# EAGLE design slaveMeteo (EAGLE 9.0.0)
DELETE: MF
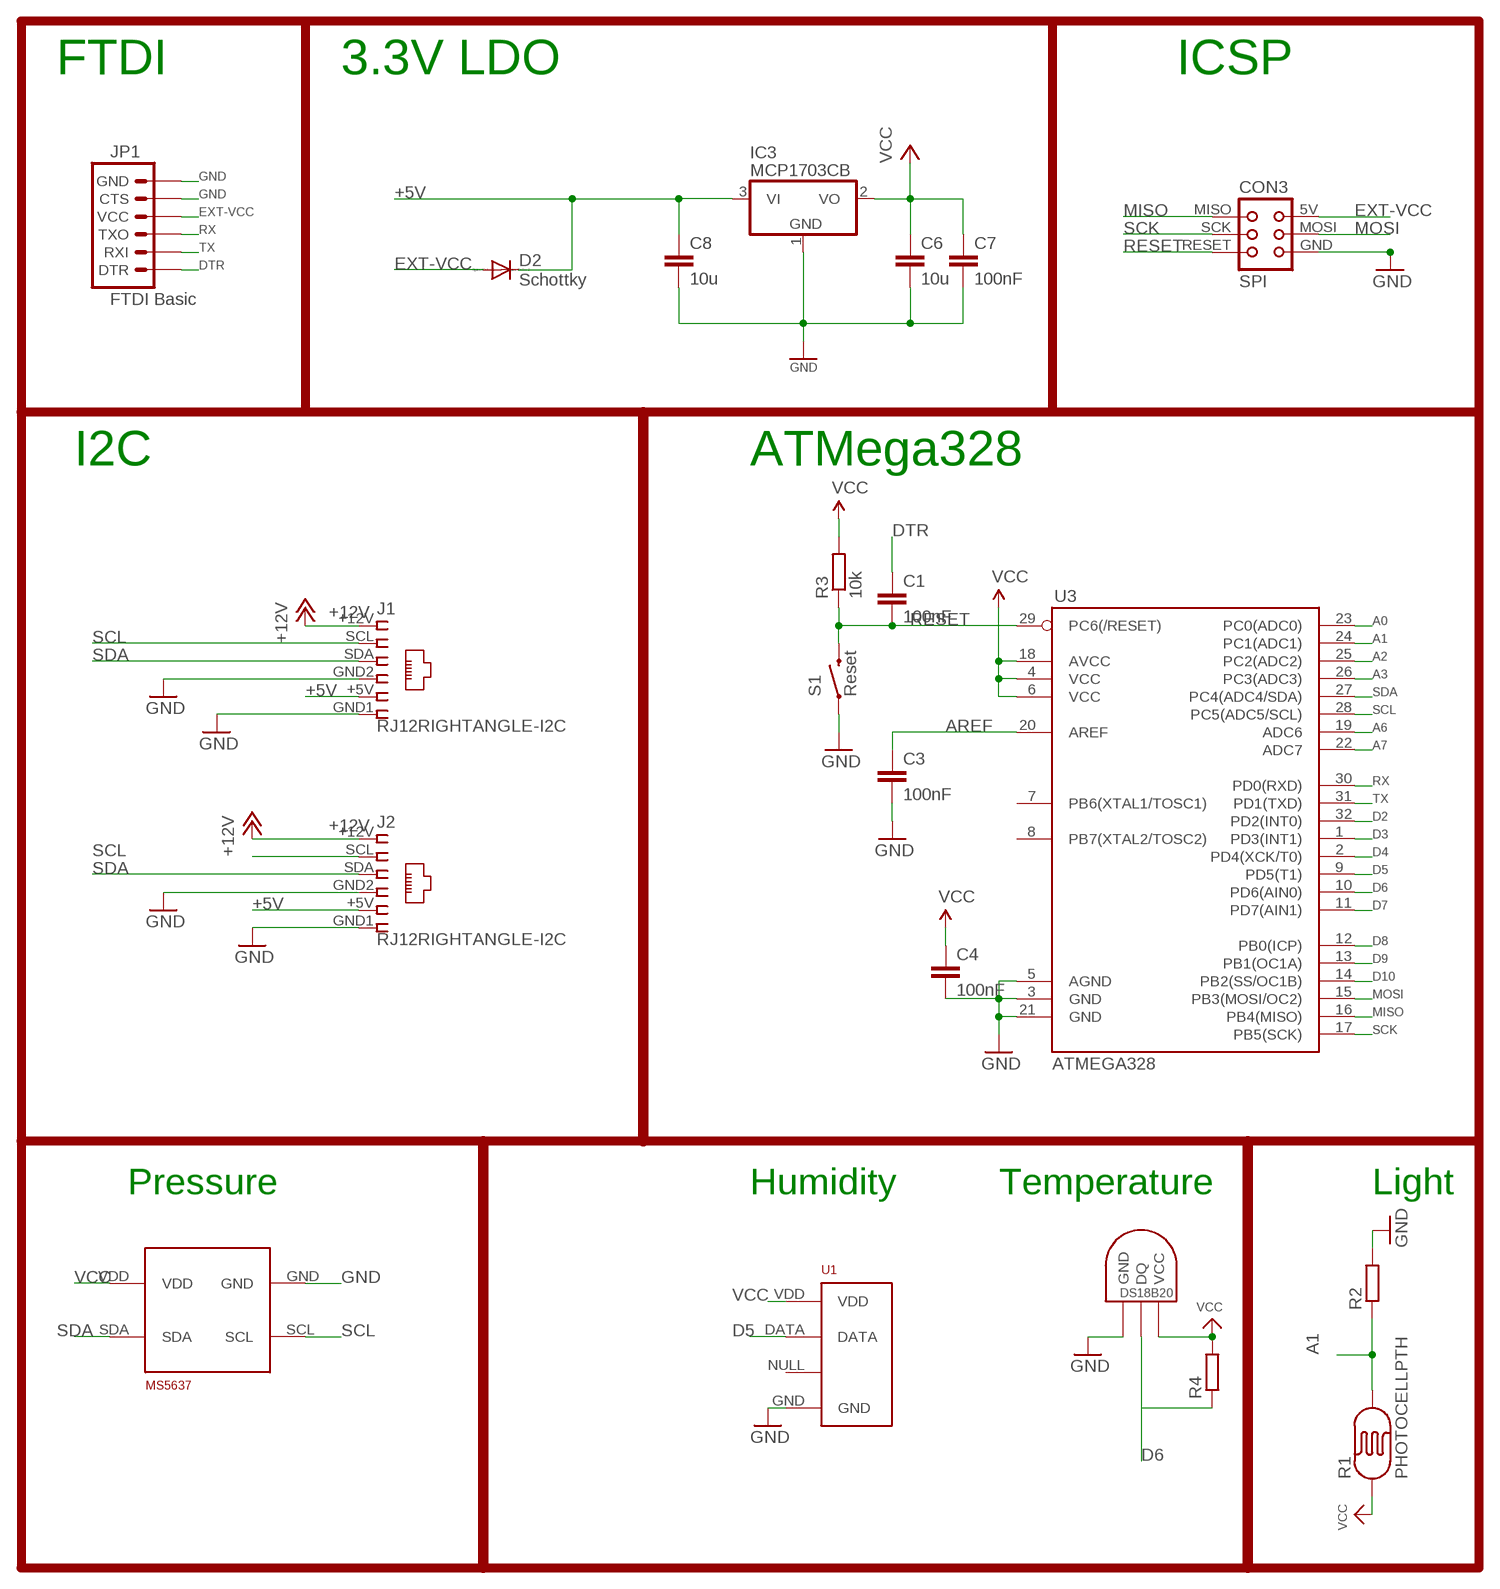
[diagram p0: schematic, sheet 1]

## Parts
C1  100nF  C-EUC0805K  [C0805K]
C3  100nF  C-EUC0805K  [C0805K]
C4  100nF  C-EUC0805K  [C0805K]
C6  10u  C-EUC0805K  [C0805K]
C7  100nF  C-EUC0805K  [C0805K]
C8  10u  C-EUC0805K  [C0805K]
CON3  SPI  TINYISPTAG  [TC2030-MCP]
D2  Schottky  MBR0520LT  [SOD123]
IC3  MCP1703CB  [SOT23]
J1  RJ12RIGHTANGLE-I2C  [RJ12-RIGHTANGLE-I2C]
J2  RJ12RIGHTANGLE-I2C  [RJ12-RIGHTANGLE-I2C]
JP1  FTDI Basic  ARDUINO_SERIAL_PROGRAMPTH  [1X06]
R1  PHOTOCELLPTH  [PHOTOCELL]
R2  R-EU_R0805  [R0805]
R3  10k  R-EU_R0805  [R0805]
R4  R-EU_R0805  [R0805]
S1  Reset  SWITCH-MOMENTARY-2SMD-ALT01  [TACTILE-SWITCH-SMD-ALT01]
U1  RHT03_DHT-22_AM2302RA  [RHT03_DHT-22/RA]
U3  ATMEGA328  ATMEGA168  [TQFP32-08]
U$1  DS1820TO92  [DS1820]
U$19  MS5637  [MS5637]

## Nets
+5V: C8.1 D2.C IC3.3(VI) J1.+5V J2.+5V
+12V [power]: J1.+12V J2.+12V
A0: U3.23(PC0(ADC0))
A1: R1.2 R2.1 U3.24(PC1(ADC1))
A2: U3.25(PC2(ADC2))
A3: U3.26(PC3(ADC3))
A6: U3.19(ADC6)
A7: U3.22(ADC7)
AREF: C3.1 U3.20(AREF)
D2: U3.32(PD2(INT0))
D3: U3.1(PD3(INT1))
D4: U3.2(PD4(XCK/T0))
D5: U1.DATA U3.9(PD5(T1))
D6: R4.1 U3.10(PD6(AIN0)) U$1.DQ
D7: U3.11(PD7(AIN1))
D8: U3.12(PB0(ICP))
D9: U3.13(PB1(OC1A))
D10: U3.14(PB2(SS/OC1B))
DTR: C1.1 JP1.1(DTR)
EXT-VCC: CON3.5V(VCC) D2.A JP1.4(VCC)
GND [power]: C3.2 C4.2 C6.2 C7.2 C8.2 CON3.GND IC3.1(GND) J1.GND1 J1.GND2 J2.GND1 J2.GND2 JP1.5(CTS) JP1.6(GND) R2.2 S1.1 S1.2 U1.GND U3.3(GND) U3.5(AGND) U3.21(GND) U$1.GND U$19.GND
MISO: CON3.MISO U3.16(PB4(MISO))
MOSI: CON3.MOSI U3.15(PB3(MOSI/OC2))
RESET: C1.2 CON3.RESET R3.1 S1.3 S1.4 U3.29(PC6(/RESET))
RX: JP1.3(TXO) U3.30(PD0(RXD))
SCK: CON3.SCK U3.17(PB5(SCK))
SCL: J1.SCL J2.SCL U3.28(PC5(ADC5/SCL)) U$19.SCL
SDA: J1.SDA J2.SDA U3.27(PC4(ADC4/SDA)) U$19.SDA
TX: JP1.2(RXI) U3.31(PD1(TXD))
VCC: C4.1 C6.1 C7.1 IC3.2(VO) R1.1 R3.2 R4.2 U1.VDD U3.4(VCC) U3.6(VCC) U3.18(AVCC) U$1.VDD(VCC) U$19.VDD
Unconnected: U1.NULL U3.7(PB6(XTAL1/TOSC1)) U3.8(PB7(XTAL2/TOSC2))

## Notes on the sheet
- FTDI | 3.3V LDO | ICSP
- I2C | ATMega328
- Pressure | Humidity | Temperature | Light

## Library data of the parts
C1 C3 C4 C7 = rcl:C-EU: CAPACITOR, European symbol; ELECROW: C49678; LCSC: C49678; MPN: 80-C1206C104K5R
C6 C8 = rcl:C-EU: CAPACITOR, European symbol; ELECROW: C15850; LCSC: C15850; MPN: 77-VJ1206V106ZXQTBC
CON3 = lpatiny:TINYISP: CONNECTOR
D2 = diode:MBR0520LT: SCHOTTKY BARRIER RECTIFIER Source: http://onsemi.com .. MBR0520LT1-D.pdf; LCSC: C82544; MPN: 621-1N5819HW-F
IC3 = linear:MCP1703: 250 mA, 16V, Low Quiescent Current LDO Regulator Source: http://ww1.microchip.com/downloads/en/DeviceDoc/22049b.pdf; LCSC: C53352
J1 J2 = lpatiny:RJ12: CORCOM Modular RJ Jacks No Shield Source: www.tycoelectronics.com .. ENG_DS_1654001_1099_RJ_L_0507.pdf
JP1 = SparkFun:ARDUINO_SERIAL_PROGRAM
R1 = SparkFun:PHOTOCELL: Photocell Also known as a CdS photoresistor. This is a low cost way to detect light levels. Resistance decreases with more incoming light. SparkFun SKU: SEN-09088
R2 R4 = resistor:R-EU_: RESISTOR, European symbol
R3 = rcl:R-EU_: RESISTOR, European symbol; ELECROW: C17513; LCSC: C17513
S1 = Testing:SWITCH-MOMENTARY-2: Various NO switches- pushbuttons, reed, etc
U1 = RHT03_DHT-22_AM2302:RHT03_DHT-22_AM2302: RHT03 / DHT-22 / AM2302 Packages and symbol for the RHT03 / DHT-22 relative humidity and temperature sensor. Note: The AM2302 is a wired version of the DHT-22 which typically requires less clearance and is thus provided as a separate package.; PROD_ID: SEN-10167
U3 = SparkFun:ATMEGA168
U$1 = Ava:DS1820: DS18B20 Programmable Resolution 1-Wire Digital Thermometer Description The DS18B20 digital thermometer provides 9-bit to 12-bit Celsius temperature measurements and has an alarm function with nonvolatile user-programmable upper and lower trigger points. The DS18B20 communicates over a 1-Wire® bus that by definition requires only one data line (and ground) for communication with a central microprocessor. It has an operating temperature range of -55°C to +125°C and is accurate to ±0.5°C over the range of -10°C to +85°C. In addition, the DS18B20 can derive power directly from the data line ("parasite power"), eliminating the need for an external power supply. Each DS18B20 has a unique 64-bit serial code, which allows multiple DS18B20s to function on the same 1-Wire bus. Thus, it is simple to use one microprocessor to control many DS18B20s distributed over a large area. Applications that can benefit from this feature include HVAC environmental controls, temperature monitoring systems inside buildings, equipment, or machinery, and process monitoring and control systems.
U$19 = MS5637:MS5637: Le MS563702BA03-50 est un Micro Altimètre ultra compact optimisé pour des applications d'altimètre et de baromètre dans des téléphones portables et des tablettes. La résolution d'altitude au niveau de la mer est de 13cm d'air. Le module de capteur comprend un capteur de pression haute linéarité et un CAN ΔΣ 24 bits ultra faible puissance avec des coefficients internes calibrés en usine. Il fournit une valeur numérique de pression et de température précise de 24 bits et différents modes de fonctionnement qui permettent à l'utilisateur d'optimiser la vitesse de conversion et la consommation de courant. La sortie de température à haute résolution permet la mise en œuvre d'une fonction altimètre / thermomètre sans capteur supplémentaire. Il peut être interfacé avec pratiquement tous les microcontrôleurs à interface I²C-bus. Le protocole de communication est simple, sans avoir à programmer des registres internes dans l'appareil. Faibles dimensions de 3 x 3 x 0.9mm³ pour une intégratio Module haute résolution, 13cm Capteur de pression numérique intégré (CAN ΔΣ 24 bits) Interface I²C Plage de pression étendue de 10 à 2000mbar Conversion rapide jusqu'à 0.5ms Faible consommation, 0.6µA (veille <=0.1µA à 25°C) Aucun composant externe (oscillateur interne)

## Net classes
0 default: width 0.406 mm, clearance 0.25 mm
1 power: width 0.406 mm, drill 0.305 mm, clearance 0.25 mm
2 VIN: width 0.406 mm, clearance 0.25 mm
3 fine: width 0.406 mm, clearance 0.25 mm
4 aref: width 0.406 mm, clearance 0.25 mm

## Board
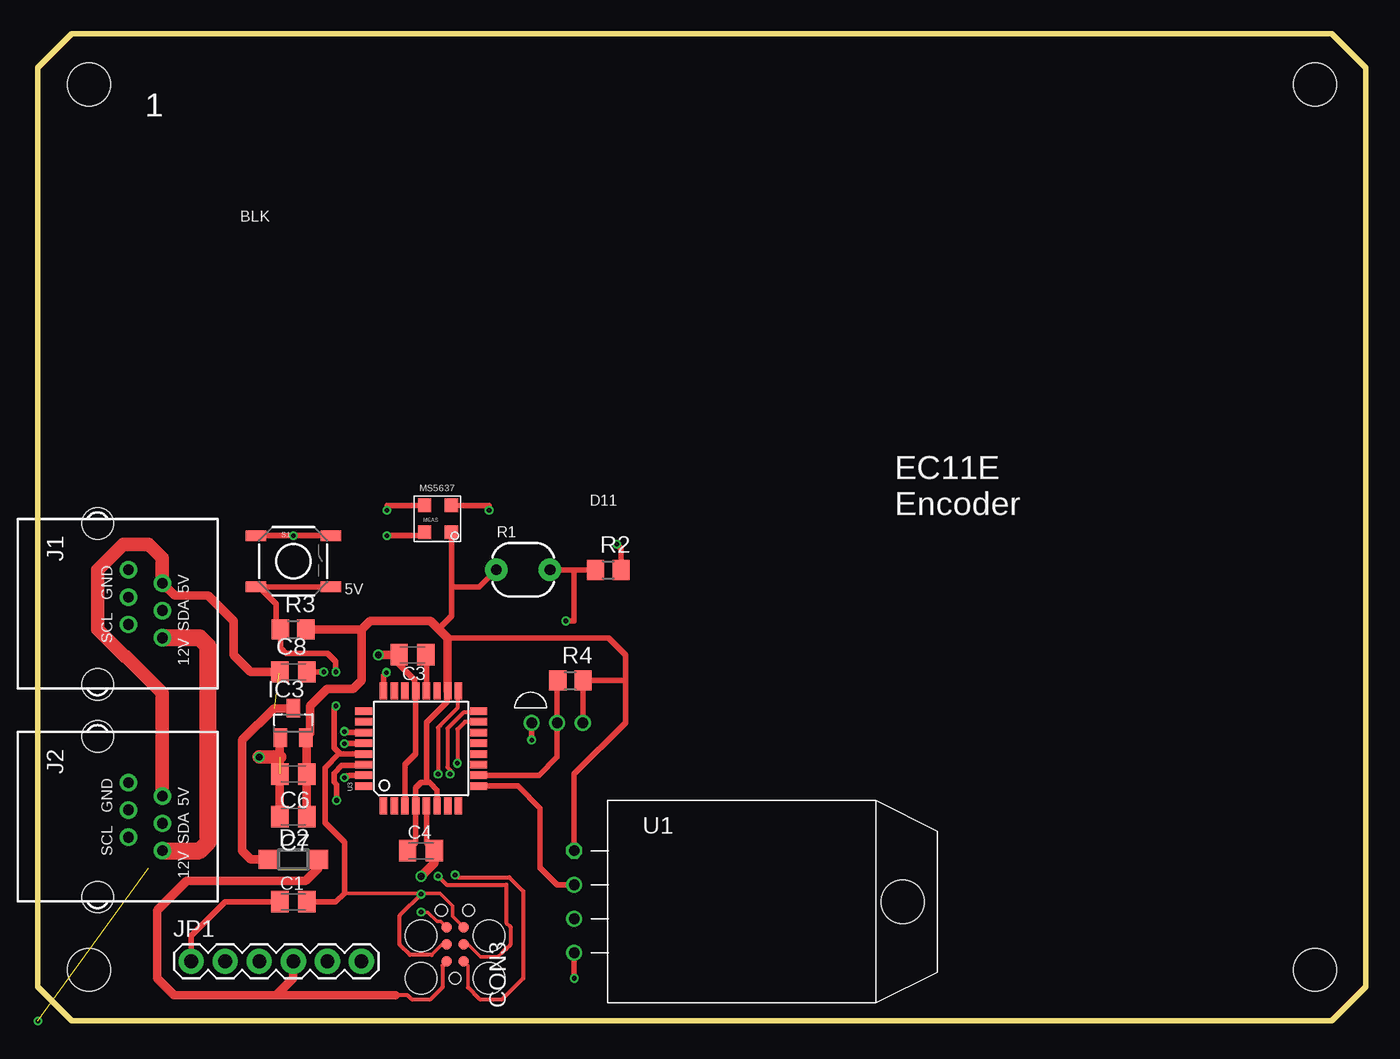
[diagram p1: board, top side]
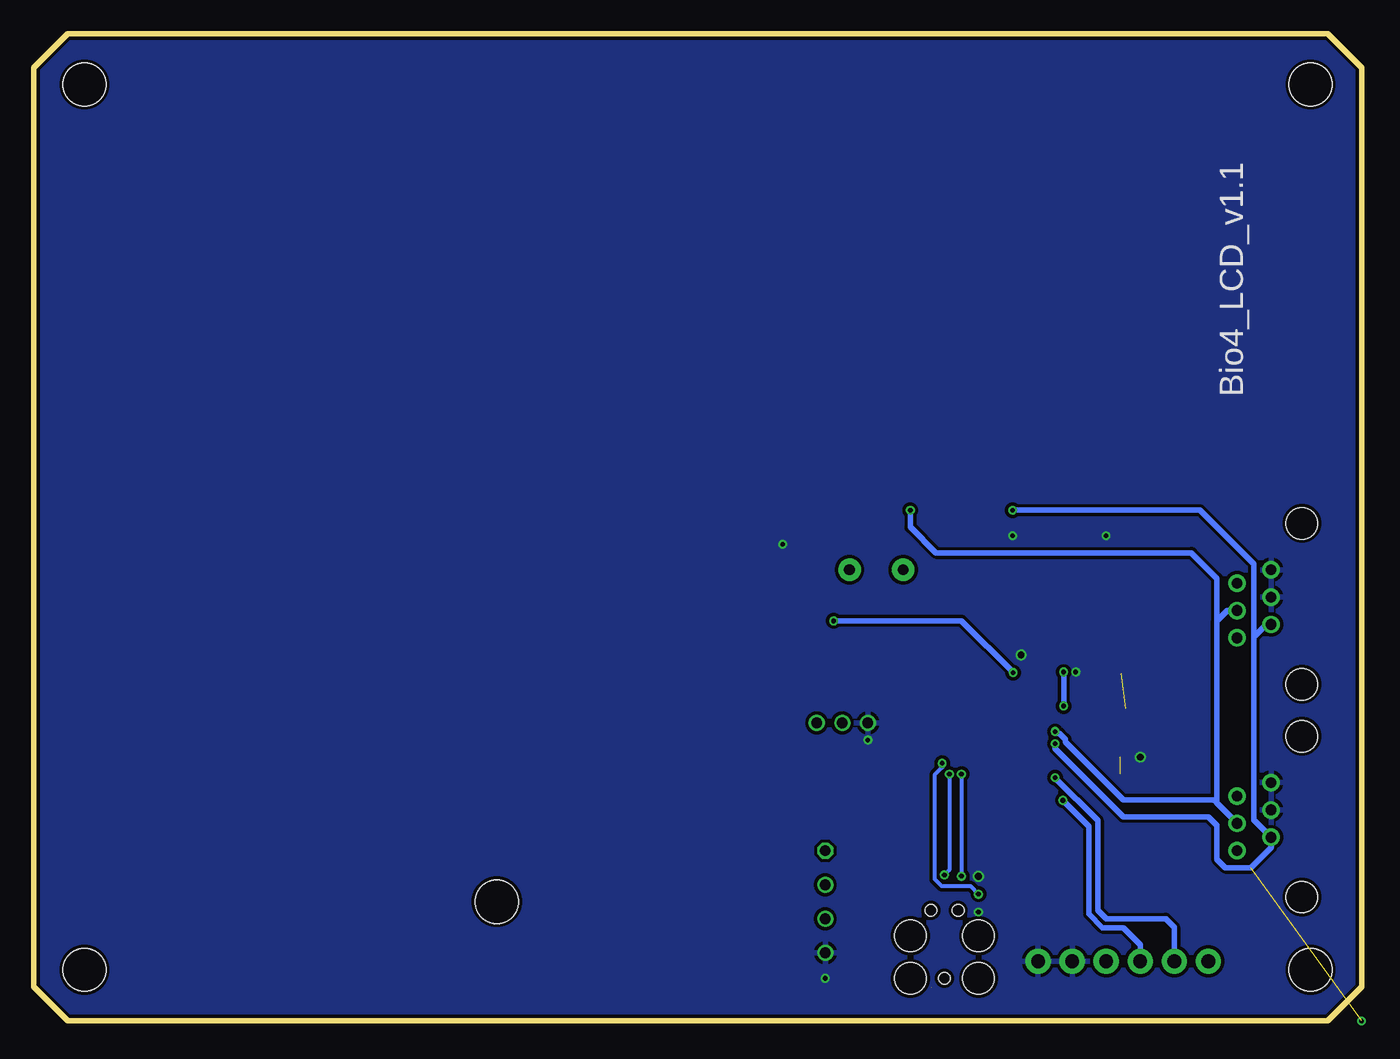
[diagram p2: board, bottom side, seen from below]

Size 99.06 x 73.66 mm. Coordinates in mm from the lower left corner, seen from the top.
Outline: 0,71.12 0,2.54 2.54,0 96.52,0 99.06,2.54 99.06,71.12 96.52,73.66 2.54,73.66 0,71.12
Copper layers (1*16): Top 0.035mm / dielectric 0.2mm / Bottom 0.035mm
Design rules "SeeedStudio_DRU_no_angle_20130527 *": minimum track width 6mil, minimum drill 12mil, track to track 6mil, track to pad 6mil, pad to pad 6mil, via to via 6mil, smd to smd 0mil, copper to edge 10mil, drill to drill 10mil, minimum pad ring 6mil, minimum via ring 6mil, stop-mask expansion 2mil, vias tented up to drill 25mil, thermal gap 10mil
Holes 3.2 mm at 3.81,69.85 3.81,3.81 95.25,69.85 95.25,3.81

### Footprints (pad centres in the part's own frame; a part is rotated, then mirrored left to right if it is on the bottom)
C0805K = smd 1.3 x 1.6: 1 -1,0; 2 1,0
TC2030-MCP = smd 0.787 x 0.787: 5V 1.27,0.635; GND 3.81,0.635; MISO 1.27,-0.635; MOSI 2.54,0.635; RESET 3.81,-0.635; SCK 2.54,-0.635 | hole 0.889: 0,0; 5.08,-1.016; 5.08,1.016 | hole 2.375: 0,2.54; 0,-2.54; 3.175,-2.54; 3.175,2.54
SOD123 = smd 1.4 x 1.4: A 1.9,0; C -1.9,0
SOT23 = smd 1 x 1.4: 1 -0.95,-1.1; 2 0.95,-1.1; 3 0,1.1
RJ12-RIGHTANGLE-I2C = drill 0.8 pad 1.3: +5V -1.54,4.84; +12V 2.54,4.84; GND1 -2.54,2.3; GND2 -0.5,2.3; SCL 1.54,2.3; SDA 0.5,4.84 | hole 2.36: -6,0; 6,0
1X06 = drill 1.016 pad 1.88: 1 0,0; 2 2.54,0; 3 5.08,0; 4 7.62,0; 5 10.16,0; 6 12.7,0
PHOTOCELL = drill 0.8 pad 1.676: 1 -2,0; 2 2,0
R0805 = smd 1.3 x 1.5: 1 -0.95,0; 2 0.95,0
TACTILE-SWITCH-SMD-ALT01 = smd 1.524 x 0.762: 1 -2.794,1.905; 2 2.794,1.905; 3 -2.794,-1.905; 4 2.794,-1.905
RHT03_DHT-22/RA = drill 0.8: DATA -1.27,0; GND 3.81,0; NULL 1.27,0 | drill 0.8 octagon: VDD -3.81,0 | hole 3.25: 0,24.5
TQFP32-08 = smd 1.27 x 0.559: 1 -4.293,2.8; 2 -4.293,2; 3 -4.293,1.2; 4 -4.293,0.4; 5 -4.293,-0.4; 6 -4.293,-1.2; 7 -4.293,-2; 8 -4.293,-2.8; 17 4.293,-2.8; 18 4.293,-2; 19 4.293,-1.2; 20 4.293,-0.4; 21 4.293,0.4; 22 4.293,1.2; 23 4.293,2; 24 4.293,2.8 | smd 0.559 x 1.27: 9 -2.8,-4.293; 10 -2,-4.293; 11 -1.2,-4.293; 12 -0.4,-4.293; 13 0.4,-4.293; 14 1.2,-4.293; 15 2,-4.293; 16 2.8,-4.293; 25 2.8,4.293; 26 2,4.293; 27 1.2,4.293; 28 0.4,4.293; 29 -0.4,4.293; 30 -1.2,4.293; 31 -2,4.293; 32 -2.8,4.293
DS1820 = drill 0.8: DQ 2.54,-1.27; GND 0.635,-1.27; VDD 4.445,-1.27
MS5637 = smd 1 x 1: GND 1,1; SCL 1,-1; SDA -1,-1; VDD -1,1

### Placement (x,y rotation side)
C1  19.05,8.89 0 top
C3  27.94,27.3 180 top
C4  28.57,12.7 0 top
C6  19.05,18.41 180 top
C7  19.05,15.24 180 top
C8  19.05,26.04 0 top
CON3  31.11,3.17 90 top
D2  19.05,12.06 0 top
IC3  19.05,22.23 0 top
J1  4.45,31.11 270 top
J2  4.45,15.24 270 top
JP1  11.43,4.45 0 top
R1  36.2,33.66 0 top
R2  42.55,33.66 0 top
R3  19.05,29.21 0 top
R4  39.71,25.4 0 top
S1  19.05,34.29 0 top
U1  40.01,8.89 270 top
U3  28.57,20.32 90 top
U$1  36.2,23.5 0 top
U$19  29.84,37.47 180 top

### Tracks (layer width: path | path; a pad name or v marks a point on that pad's centre or on a via)
+5V  (1 unrouted)
  Top 0.635: D2.C 15.88,12.06 15.24,12.7 15.24,20.95 17.61,23.32 IC3.3 | J1.+5V 10.19,31.75 12.7,31.75 14.61,29.84 14.61,27.3 15.88,26.04 C8.1
  Top 1.016: J2.+5V 9.29,24.45 6.56,27.18 6.48,27.18 4.45,29.21 4.45,33.66 6.35,35.56 8.26,35.56 9.29,34.53 J1.+5V
  Top 1.27: 17.95,25.93 C8.1
+12V
  Top 1.27: J2.+12V 12.06,12.7 12.7,13.34 12.7,27.94 12.06,28.57 J1.+12V
A1  (via drill 0.35)
  Top 0.406: R1.2 40.01,33.66 | 40.01,33.66 R2.1 | U3.24 25.77,25.77 v25.99,25.99 | v39.37,29.84 40.01,29.84 40.01,33.66
  Bottom 0.406: v39.37,29.84 29.84,29.84 v25.99,25.99
AREF
  Top 0.406: U3.20 28.98,27.27 C3.1
D5
  Top 0.406: U3.9 35.82,17.52 37.47,15.88 37.47,11.43 38.73,10.16 U1.DATA
D6
  Top 0.406: R4.1 38.73,25.37 U$1.DQ 38.73,19.68 37.37,18.32 U3.10
DTR
  Top 0.406: JP1.1 11.43,6.35 13.97,8.89 C1.1
EXT-VCC
  Top 0.305: 26.67,1.91 27.59,1.91 27.91,1.58 29.23,1.58 30.17,2.52 30.17,4.13 CON3.5V
  Top 0.635: JP1.4 19.05,3.17 17.78,1.91 | 17.78,1.91 10.16,1.91 8.89,3.17 8.89,8.26 11.09,10.46 19.98,10.46 20.95,11.43 D2.A | 26.67,1.91 17.78,1.91
GND  (via drill 0.35, 0.5)  (1 unrouted)
  Top 0.254: CON3.GND 30.04,7.43 29.76,7.43 29.07,8.12 v28.57,8.12
  Top 0.406: U3.5 28.98,13.3 C4.2 | U3.3 27.38,19.12 28.18,19.92 U3.21 28.11,24.68 28.11,25.43 26.94,26.6 C3.2 | S1.2 v19.05,36.2 S1.1 | C8.2 v21.32,26.04 | U$19.GND 28.57,36.2 v26.04,36.2 | U$1.GND v36.83,20.95 | R2.2 43.49,35.24 v43.18,35.56 | U1.GND v40.01,3.17
  Top 0.635: IC3.1 18.05,21.07 C6.2 C7.2 | C3.2 v25.4,27.3 | C4.2 29.57,11.79 v28.57,10.79
  Top 1.016: 18.05,19.68 v16.51,19.68
  pour Bottom: 0,71.12 0,2.54 2.54,0 96.52,0 99.06,2.54 99.06,71.12 96.52,73.66 2.54,73.66
MISO  (via drill 0.35)  (1 unrouted)
  Top 0.254: CON3.MISO 32.09,4.11 32.09,2.52
  Top 0.305: U3.16 32.75,23 31.74,23 30.56,21.82 30.56,18.92 30.75,18.73 v30.75,18.41 | v31.11,10.89 31.29,10.71 35.16,10.71 36.2,9.68 36.2,3.17 34.6,1.58 32.99,1.58 32.07,2.51
  Bottom 0.305: v30.75,18.41 30.75,11.26 v31.11,10.89
MOSI  (via drill 0.35)
  Top 0.254: CON3.MOSI 30.16,5.71 29.37,4.92
  Top 0.305: U3.15 31.84,22.32 31.29,21.76 v31.29,19.22 | v28.57,9.46 26.98,7.86 26.98,5.69 27.75,4.92 29.37,4.92
  Bottom 0.305: v31.29,19.22 31.29,18.91 31.84,18.35 31.84,10.59 31.32,10.06 29.18,10.06 v28.57,9.46
RESET  (via drill 0.35)
  Top 0.254: CON3.RESET 30.92,7.81 30.92,8.6 30,9.53 22.86,9.53
  Top 0.406: 22.54,19.91 22.86,19.91 23.18,19.91 23.2,19.92 U3.29 | 22.54,19.91 22.08,20.36 22.08,21.59 22.08,23.35 v22.23,23.5 | 22.54,19.91 22.45,19.91 21.42,18.88 21.42,17.55 21.43,17.54 21.43,14.76 22.86,13.34 22.86,9.53 22.23,8.89 C1.2 | v22.23,26.04 22.23,26.81 21.6,27.43 18.52,27.43 18.1,27.85 R3.1 17.78,29.53 17.78,31.11 16.51,32.38 S1.3 S1.4
  Bottom 0.406: v22.23,23.5 v22.23,26.04
RX  (via drill 0.35)
  Top 0.406: U3.30 24.21,19.05 22.66,19.05 22.08,18.47 22.08,17.82 22.28,17.62 v22.28,16.46
  Bottom 0.406: v22.28,16.46 20.34,14.52 20.34,7.98 19.32,6.96 17.78,6.96 16.51,5.69 JP1.3
SCK  (via drill 0.35)
  Top 0.254: CON3.SCK 32.07,5.71 33.01,4.78 34.3,4.78 34.6,5.08
  Top 0.305: U3.17 31.3,24.53 31.3,23.34 30.01,22.06 | v29.84,10.79 30.48,10.16 34.92,10.16 34.92,7.33 35.25,7.01 35.25,5.69 34.92,5.37 34.89,5.37 34.6,5.08 | 30.01,22.06 30,22.05 | 30.01,22.06 29.84,21.89 v29.84,18.41
  Bottom 0.305: v29.84,18.41 v29.84,10.79
SCL  (via drill 0.35)  (1 unrouted)
  Top 0.406: U3.28 22.89,20.72 v22.86,20.68 | U$19.SCL 26.04,38.47 v26.04,38.1
  Bottom 0.406: 8.06,28.63 8.06,15.01 J2.SCL 6.75,12.94 8.26,11.43 10.16,11.43 10.79,12.06 10.79,14.61 11.43,15.24 17.78,15.24 22.86,20.32 v22.86,20.68 | 8.06,28.63 7.12,29.57 J1.SCL | v26.04,38.1 12.06,38.1 8.06,34.09 8.06,28.63
  other vias: 0,0
SDA  (via drill 0.35)
  Top 0.406: U3.27 22.93,21.52 v22.86,21.59 | U$19.SDA 33.66,38.47 v33.66,38.1
  Bottom 0.406: J1.SDA 10.03,30.61 10.79,29.84 | 10.79,16.25 10.79,29.21 10.79,29.84 | 10.79,16.25 J2.SDA | 10.79,16.25 11.05,16.51 17.78,16.51 22.08,20.81 22.08,21.01 22.54,21.47 22.74,21.47 v22.86,21.59 | v33.66,38.1 33.66,36.83 31.75,34.92 12.7,34.92 10.79,33.02 10.79,29.84
TX  (via drill 0.35)
  Top 0.406: U3.31 23.23,18.32 23.18,18.27 22.98,18.27 v22.86,18.14
  Bottom 0.406: v22.86,18.14 19.68,14.97 19.68,8.26 19.05,7.62 14.61,7.62 13.97,6.99 JP1.2
VCC
  Top 0.406: C4.1 28.18,13.3 U3.4 28.18,17.38 28.57,17.78 28.98,17.78 | U3.6 29.77,17.21 29.21,17.78 28.98,17.78 | 28.98,17.78 28.98,22.26 30.51,23.79 30.51,24.55 U3.18 | 29.88,29.25 30.84,30.21 30.84,32.38 | U$19.VDD 30.84,32.38 | 34.2,33.56 R1.1 32.92,32.38 30.84,32.38 | U$1.VDD 40.66,22.25 R4.2 43.81,25.4 | 43.81,25.4 43.81,27.3 42.56,28.56 30.57,28.56 | 43.81,25.4 43.81,22.86 43.81,22.23 40.01,18.41 U1.VDD
  Top 0.635: 24.13,29.21 24.13,25.4 23.5,24.77 21.59,24.77 20.32,23.5 20.32,21.45 IC3.2 20.05,21.07 C6.1 C7.1 | 24.13,29.21 24.77,29.84 29.29,29.84 29.88,29.25 30.57,28.56 U3.18 | 24.13,29.21 R3.2

### Text on the board
tNames: 1 | BLK | D11 | EC11E / Encoder | 5V
bNames: Bio4_LCD_v1.1
tValues: Simple spectro / V 1.6.0
bValues: Simple spectro / V1.6.0